# EAGLE schematic example (EAGLE 7.2.0)
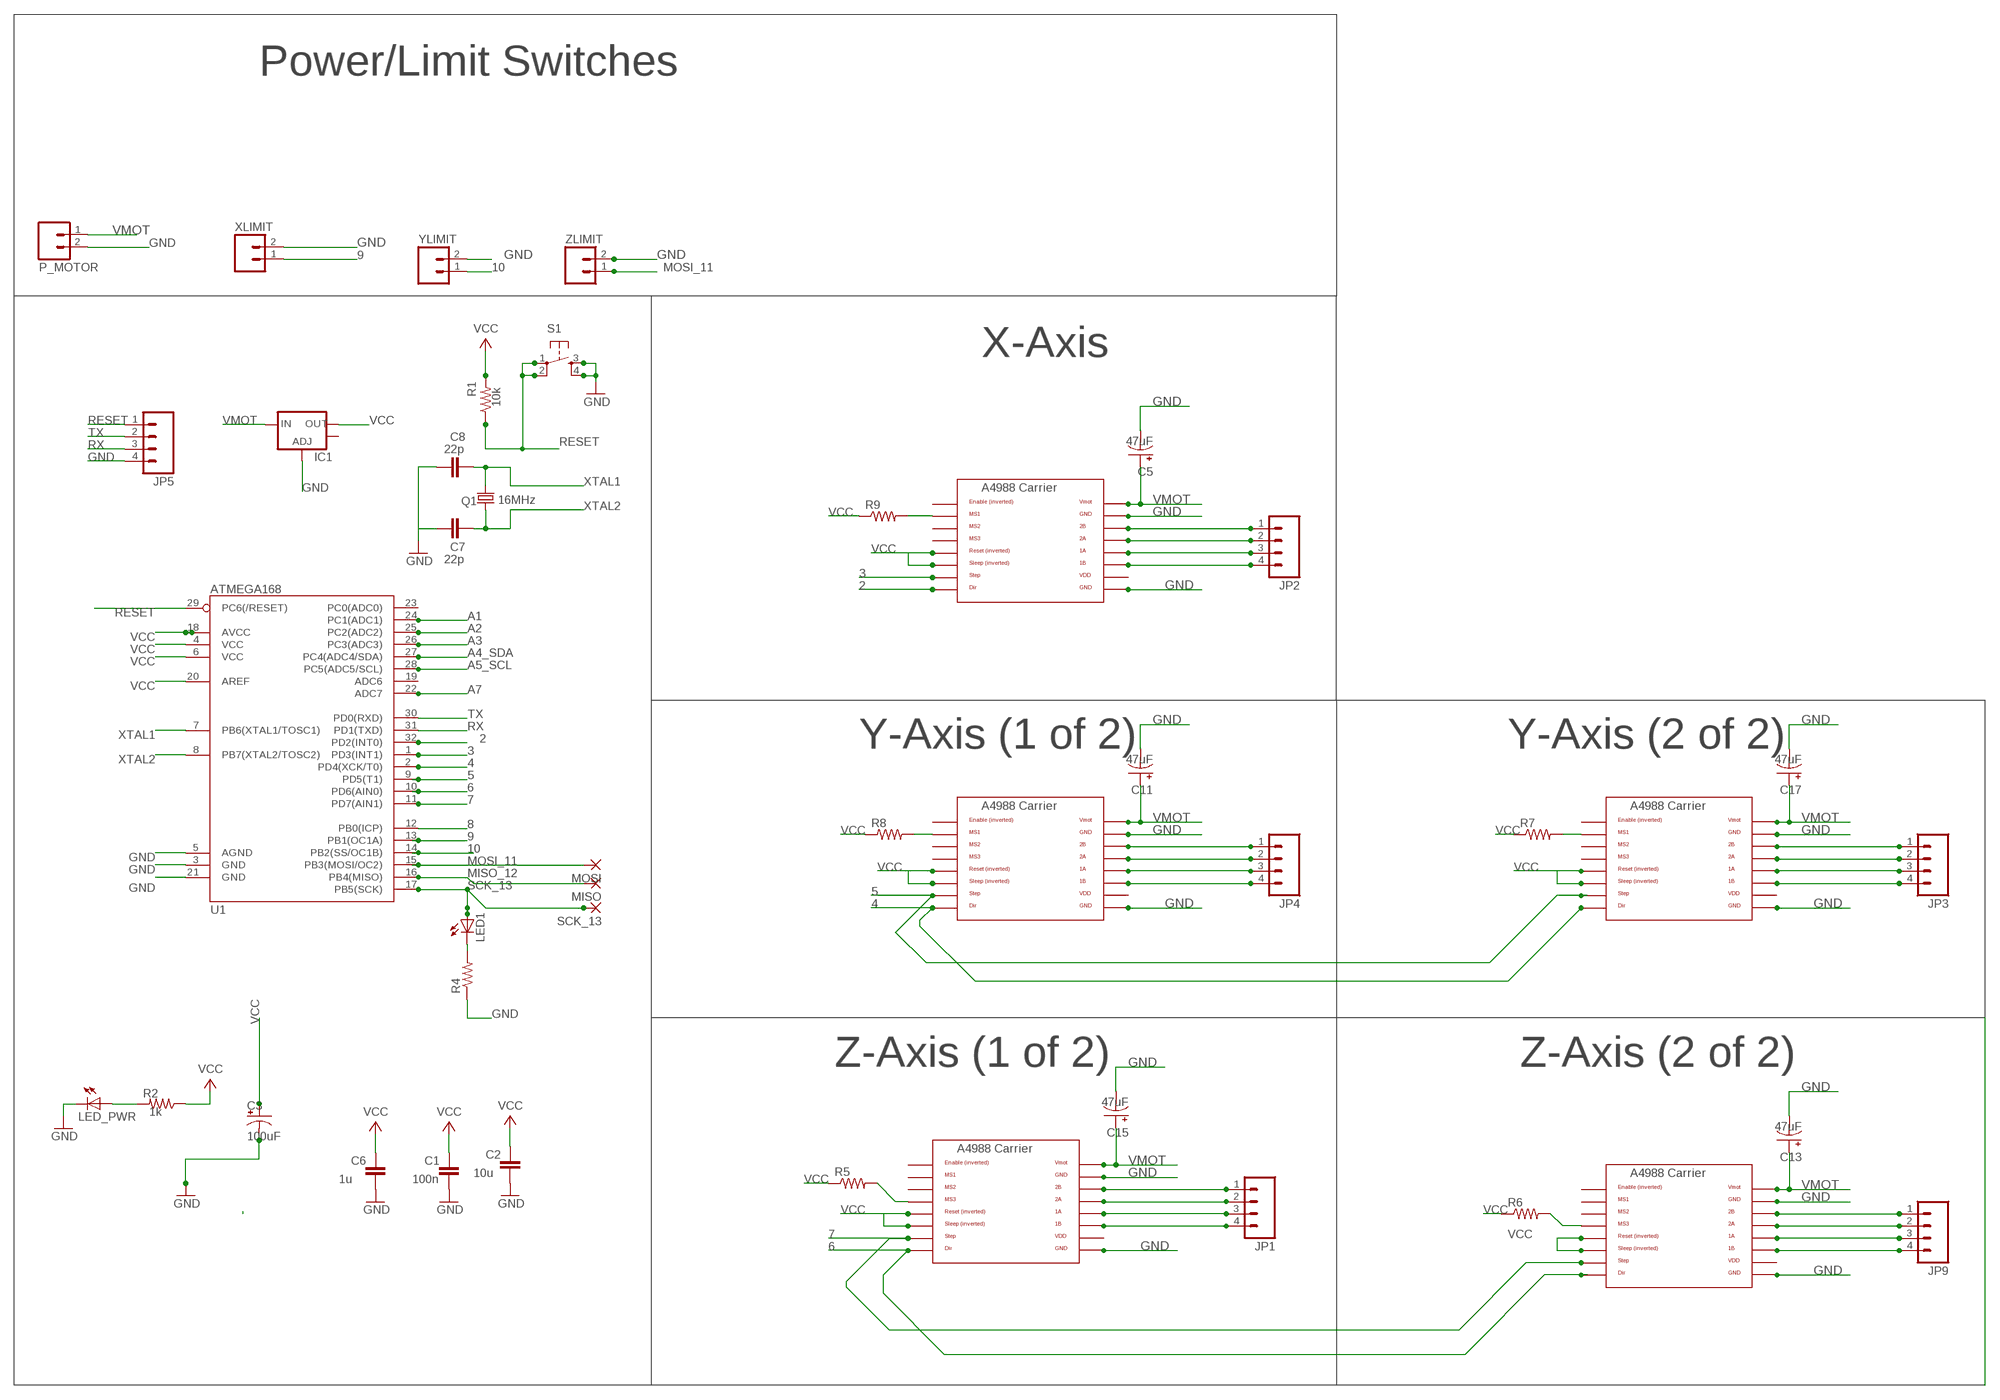
[diagram p0: schematic, sheet 1]

## Parts
C1  100n  C-EUC1206  [C1206]
C2  10u  C-EUC1206  [C1206]
C3  100uF  CAP_POLE  [PANASONIC_E]
C5  47uF  CPOL-US153CLV-0605  [153CLV-0605]
C6  1u  C-EUC1206  [C1206]
C7  22p  C-EUC1206  [C1206]
C8  22p  C-EUC1206  [C1206]
C11  47uF  CPOL-US153CLV-0605  [153CLV-0605]
C13  47uF  CPOL-US153CLV-0605  [153CLV-0605]
C15  47uF  CPOL-US153CLV-0605  [153CLV-0605]
C17  47uF  CPOL-US153CLV-0605  [153CLV-0605]
IC1  V_REG_LM1117SOT223  [SOT223]
JP1  M04SMD  [1X04-SMD]
JP2  M04SMD  [1X04-SMD]
JP3  M04SMD  [1X04-SMD]
JP4  M04SMD  [1X04-SMD]
JP5  M04LONGPADS  [1X04_LONGPADS]
JP9  M04SMD  [1X04-SMD]
LED1  LEDSMT1206  [1206]
LED_PWR  LEDSMT1206  [1206]
MISO  SMD2  [SMD1,27-2,54]
MOSI  SMD2  [SMD1,27-2,54]
P_MOTOR  M02-JST-2MM-SMT  [S2B-PH]
Q1  16MHz  CRYSTALSM49  [SM49]
R1  10k  R-US_R1206  [R1206]
R2  1k  R-US_R1206  [R1206]
R4  R-US_R1206  [R1206]
R5  RESISTOR1206  [1206]
R6  RESISTOR1206  [1206]
R7  RESISTOR1206  [1206]
R8  RESISTOR1206  [1206]
R9  RESISTOR1206  [1206]
S1  6MM_SWITCH6MM_SWITCH  [6MM_SWITCH]
SCK_13  SMD2  [SMD1,27-2,54]
U1  ATMEGA168  [TQFP32-08]
XAXIS  A4988BREAKOUT  [A4988BREAKOUT]
XLIMIT  M02  [1X02_LONGPADS]
YAXIS1  A4988BREAKOUT  [A4988BREAKOUT]
YAXIS2  A4988BREAKOUT  [A4988BREAKOUT]
YLIMIT  M02  [1X02_LONGPADS]
ZAXIS1  A4988BREAKOUT  [A4988BREAKOUT]
ZAXIS2  A4988BREAKOUT  [A4988BREAKOUT]
ZLIMIT  M02  [1X02_LONGPADS]

## Nets
2: U1.32(PD2(INT0)) XAXIS.DIR
3: U1.1(PD3(INT1)) XAXIS.STEP
4: U1.2(PD4(XCK/T0)) YAXIS1.DIR YAXIS2.DIR
5: U1.9(PD5(T1)) YAXIS1.STEP YAXIS2.STEP
6: U1.10(PD6(AIN0)) ZAXIS1.DIR ZAXIS2.DIR
7: U1.11(PD7(AIN1)) ZAXIS1.STEP ZAXIS2.STEP
8: U1.12(PB0(ICP))
9: U1.13(PB1(OC1A)) XLIMIT.1
10: U1.14(PB2(SS/OC1B)) YLIMIT.1
A1: U1.24(PC1(ADC1))
A2: U1.25(PC2(ADC2))
A3: U1.26(PC3(ADC3))
A4_SDA: U1.27(PC4(ADC4/SDA))
A5_SCL: U1.28(PC5(ADC5/SCL))
A7: U1.22(ADC7)
GND: C1.2 C2.2 C3.- C5.- C6.2 C7.1 C8.1 C11.- C13.- C15.- C17.- IC1.1(ADJ) JP5.4 LED_PWR.C P_MOTOR.2 R4.1 S1.3(S) S1.4(S1) U1.3(GND) U1.5(AGND) U1.21(GND) XAXIS.GND XAXIS.GND@0(GND) XLIMIT.2 YAXIS1.GND YAXIS1.GND@0(GND) YAXIS2.GND YAXIS2.GND@0(GND) YLIMIT.2 ZAXIS1.GND ZAXIS1.GND@0(GND) ZAXIS2.GND ZAXIS2.GND@0(GND) ZLIMIT.2
MISO_12: MISO.1(P) U1.16(PB4(MISO))
MOSI_11: MOSI.1(P) U1.15(PB3(MOSI/OC2)) ZLIMIT.1
N$1: LED_PWR.A R2.2
N$3: R7.2 YAXIS2.MS1
N$4: JP1.2 ZAXIS2.2A
N$5: JP1.1 ZAXIS2.2B
N$6: LED1.C R4.2
N$7: JP1.3 ZAXIS2.1A
N$9: JP2.1 XAXIS.2B
N$10: JP2.2 XAXIS.2A
N$11: JP2.3 XAXIS.1A
N$12: JP2.4 XAXIS.1B
N$14: JP1.4 ZAXIS2.1B
N$16: JP3.2 YAXIS2.2A
N$18: JP4.2 YAXIS1.2A
N$19: JP4.1 YAXIS1.2B
N$20: JP4.3 YAXIS1.1A
N$21: JP4.4 YAXIS1.1B
N$22: JP3.1 YAXIS2.2B
N$23: JP3.3 YAXIS2.1A
N$24: JP3.4 YAXIS2.1B
N$25: JP9.2 ZAXIS1.2A
N$31: JP9.1 ZAXIS1.2B
N$35: R5.2 ZAXIS2.MS3
N$36: JP9.3 ZAXIS1.1A
N$37: JP9.4 ZAXIS1.1B
N$38: R6.2 ZAXIS1.MS3
N$39: R8.2 YAXIS1.MS1
N$41: R9.2 XAXIS.MS1
RESET: JP5.1 R1.1 S1.1(P) S1.2(P1) U1.29(PC6(/RESET))
RX: JP5.3 U1.31(PD1(TXD))
SCK_13: LED1.A SCK_13.1(P) U1.17(PB5(SCK))
TX: JP5.2 U1.30(PD0(RXD))
VCC: C1.1 C2.1 C3.+ C6.1 IC1.2(OUT) R1.2 R2.1 R5.1 R6.1 R7.1 R8.1 R9.1 U1.4(VCC) U1.6(VCC) U1.18(AVCC) U1.20(AREF) XAXIS.RST XAXIS.SLP(SLEEP) YAXIS1.RST YAXIS1.SLP(SLEEP) YAXIS2.RST YAXIS2.SLP(SLEEP) ZAXIS1.RST ZAXIS1.SLP(SLEEP) ZAXIS2.RST ZAXIS2.SLP(SLEEP)
VMOT: C5.+ C11.+ C13.+ C15.+ C17.+ IC1.3(IN) P_MOTOR.1 XAXIS.VMOT YAXIS1.VMOT YAXIS2.VMOT ZAXIS1.VMOT ZAXIS2.VMOT
XTAL1: C8.2 Q1.2 U1.7(PB6(XTAL1/TOSC1))
XTAL2: C7.2 Q1.1 U1.8(PB7(XTAL2/TOSC2))
Unconnected: IC1.4(OUT) U1.19(ADC6) U1.23(PC0(ADC0)) XAXIS.EN XAXIS.MS2 XAXIS.MS3 YAXIS1.EN YAXIS1.MS2 YAXIS1.MS3 YAXIS2.EN YAXIS2.MS2 YAXIS2.MS3 ZAXIS1.EN ZAXIS1.MS1 ZAXIS1.MS2 ZAXIS2.EN ZAXIS2.MS1 ZAXIS2.MS2

## Notes on the sheet
- Power/Limit Switches
- X-Axis
- Y-Axis (1 of 2) | Y-Axis (2 of 2)
- Z-Axis (1 of 2) | Z-Axis (2 of 2)

## Power pins joined to a net without a drawn wire
VDD: XAXIS.VDD YAXIS1.VDD YAXIS2.VDD ZAXIS1.VDD ZAXIS2.VDD

## Library data of the parts
C1 C2 C6-C8 = rcl:C-EU: CAPACITOR, European symbol
C3 = 01_SparkFun:CAP_POL: Capacitor Polarized These are standard SMD and PTH capacitors. Normally 10uF, 47uF, and 100uF in electrolytic and tantalum varieties. Always verify the external diameter of the through hole cap, it varies with capacity, voltage, and manufacturer. The EIA devices should be standard.
C5 C11 C13 C15 C17 = 01_adafruit:CPOL-US: POLARIZED CAPACITOR, American symbol
IC1 = 01_SparkFun:V_REG_LM1117: Voltage Regulator LM1117 Standard adjustable voltage regulator but in SMD form. Spark Fun Electronics SKU : COM-00595
JP1-JP4 JP9 = SparkFun-Connectors:M04: Header 4 Standard 4-pin 0.1" header. Use with straight break away headers (SKU : PRT-00116), right angle break away headers (PRT-00553), swiss pins (PRT-00743), machine pins (PRT-00117), and female headers (PRT-00115). Molex polarized connector foot print use with SKU : PRT-08231 with associated ...
JP5 = 01_SparkFun:M04: Header 4 Standard 4-pin 0.1" header. Use with straight break away headers (SKU : PRT-00116), right angle break away headers (PRT-00553), swiss pins (PRT-00743), machine pins (PRT-00117), and female headers (PRT-00115). Molex polarized connector foot print use with SKU : PRT-08231 with associated ...
LED1 = 01_adafruit:LED: LED
LED_PWR = led:LED: LED
MISO MOSI SCK_13 = wirepad:SMD2: SMD PAD
P_MOTOR XLIMIT YLIMIT ZLIMIT = 01_SparkFun:M02: Header 2 Standard 2-pin 0.1" header. Use with straight break away headers (SKU : PRT-00116), right angle break away headers (PRT-00553), swiss pins (PRT-00743), machine pins (PRT-00117), and female headers (PRT-00115). Molex polarized connector foot print use with SKU : PRT-08233 with associated crimp pins and housings.
Q1 = crystal:CRYSTAL: CRYSTAL; OC_FARNELL: unknown; OC_NEWARK: unknown
R1 R2 = rcl:R-US_: RESISTOR, American symbol
R4 = 01_adafruit:R-US_: RESISTOR, American symbol
R5-R9 = 01_SparkFun:RESISTOR: Resistor Basic schematic elements and footprints for 0603, 1206, and PTH 1/10th watt (small) resistors.
S1 = 01_fab:6MM_SWITCH: OMRON SWITCH
U1 = 01_SparkFun:ATMEGA168
XAXIS YAXIS1 YAXIS2 ZAXIS1 ZAXIS2 = RepRapjr:A4988BREAKOUT

## Net classes
0 default: width 0.203 mm
1 power: width 0.305 mm, drill 0.711 mm, clearance 0.305 mm
2 gnd: width 0.305 mm, drill 0.711 mm, clearance 0.254 mm
3 usbvcc: width 0.508 mm, drill 0.711 mm, clearance 0.254 mm
4 aref: width 0.305 mm